# EAGLE schematic Rocketman_RevA (EAGLE 6.5.0)
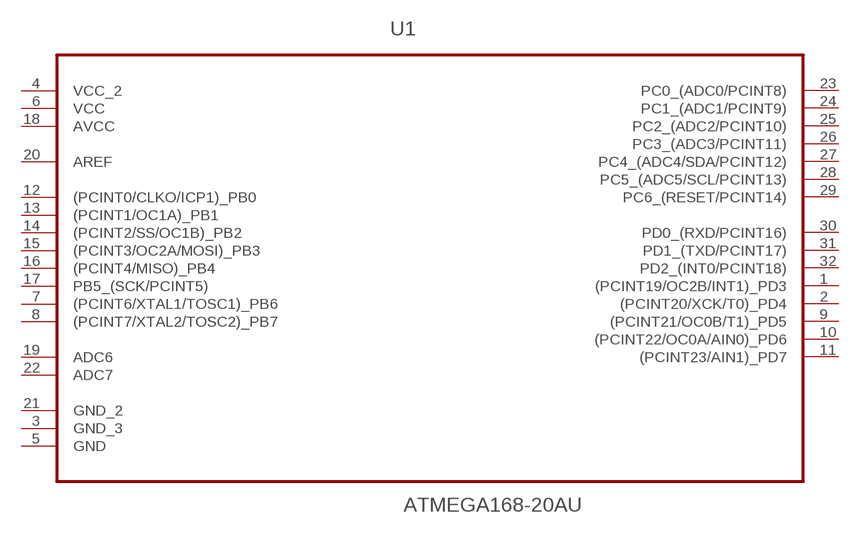
[diagram p0: schematic, sheet 1]

## Parts
U1  ATMEGA168-20AU  [QFP80P900X900X120-32N]
Unconnected: U1.1((PCINT19/OC2B/INT1)_PD3) U1.2((PCINT20/XCK/T0)_PD4) U1.3(GND_3) U1.5(GND) U1.7((PCINT6/XTAL1/TOSC1)_PB6) U1.8((PCINT7/XTAL2/TOSC2)_PB7) U1.9((PCINT21/OC0B/T1)_PD5) U1.10((PCINT22/OC0A/AIN0)_PD6) U1.11((PCINT23/AIN1)_PD7) U1.12((PCINT0/CLKO/ICP1)_PB0) U1.13((PCINT1/OC1A)_PB1) U1.14((PCINT2/SS/OC1B)_PB2) U1.15((PCINT3/OC2A/MOSI)_PB3) U1.16((PCINT4/MISO)_PB4) U1.17(PB5_(SCK/PCINT5)) U1.19(ADC6) U1.20(AREF) U1.21(GND_2) U1.22(ADC7) U1.23(PC0_(ADC0/PCINT8)) U1.24(PC1_(ADC1/PCINT9)) U1.25(PC2_(ADC2/PCINT10)) U1.26(PC3_(ADC3/PCINT11)) U1.27(PC4_(ADC4/SDA/PCINT12)) U1.28(PC5_(ADC5/SCL/PCINT13)) U1.29(PC6_(RESET/PCINT14)) U1.30(PD0_(RXD/PCINT16)) U1.31(PD1_(TXD/PCINT17)) U1.32(PD2_(INT0/PCINT18))

## Power pins joined to a net without a drawn wire
AVCC: U1.18(AVCC)
VCC: U1.6(VCC)
VCC_2: U1.4(VCC_2)

## Library data of the parts
U1 = atmega168:ATMEGA168-20AU: Microcontroller; DESCRIPTION: Microcontroller; MPN: ATMEGA168-20AU; OC_FARNELL: 9171193; OC_NEWARK: 01M6891; PACKAGE: QFP-32; SUPPLIER: ATMEL